# EAGLE schematic ATTiny85_Breakout (EAGLE 6.4)
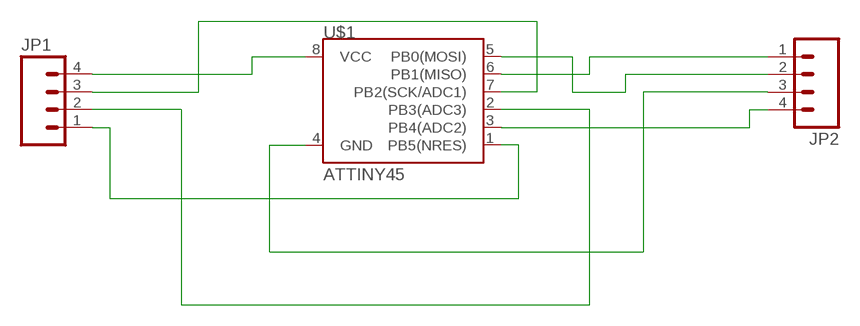
[diagram p0: schematic, sheet 1]

## Parts
JP1  M04LOCK  [1X04_LOCK]
JP2  M04LOCK  [1X04_LOCK]
U$1  ATTINY45  [SO08-EIAJ]

## Nets
GND: JP2.3 U$1.4(GND)
PB0: JP2.2 U$1.5(PB0(MOSI))
PB1: JP2.1 U$1.6(PB1(MISO))
PB2: JP1.3 U$1.7(PB2(SCK/ADC1))
PB3: JP1.2 U$1.2(PB3(ADC3))
PB4: JP2.4 U$1.3(PB4(ADC2))
PB5: JP1.1 U$1.1(PB5(NRES))
VCC: JP1.4 U$1.8(VCC)

## Library data of the parts
JP1 JP2 = SparkFun:M04: Header 4 Standard 4-pin 0.1" header. Use with straight break away headers (SKU : PRT-00116), right angle break away headers (PRT-00553), swiss pins (PRT-00743), machine pins (PRT-00117), and female headers (PRT-00115). Molex polarized connector foot print use with SKU : PRT-08231 with associated crimp pins and housings. 1MM SMD Version SKU: PRT-10208
U$1 = SparkFun:ATTINY45: Atmel ATTiny45